# EAGLE design I2C_10p_header (EAGLE 9.6.2)
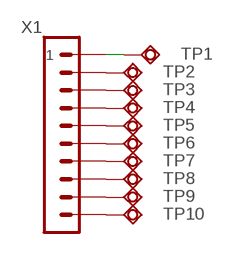
[diagram p0: schematic, sheet 1]

## Parts
TP1  PAD1.5X3.0  [PAD1.5X3.0]
TP2  PAD1.5X3.0  [PAD1.5X3.0]
TP3  PAD1.5X3.0  [PAD1.5X3.0]
TP4  PAD1.5X3.0  [PAD1.5X3.0]
TP5  PAD1.5X3.0  [PAD1.5X3.0]
TP6  PAD1.5X3.0  [PAD1.5X3.0]
TP7  PAD1.5X3.0  [PAD1.5X3.0]
TP8  PAD1.5X3.0  [PAD1.5X3.0]
TP9  PAD1.5X3.0  [PAD1.5X3.0]
TP10  PAD1.5X3.0  [PAD1.5X3.0]
X1  FFC_10PV  [FFC_1X10_VERTICAL]

## Nets
N$1: TP1.P$1 X1.P$1
N$2: TP2.P$1 X1.P$2
N$3: TP3.P$1 X1.P$3
N$4: TP4.P$1 X1.P$4
N$5: TP5.P$1 X1.P$5
N$6: TP6.P$1 X1.P$6
N$7: TP7.P$1 X1.P$7
N$8: TP8.P$1 X1.P$8
N$9: TP9.P$1 X1.P$9
N$10: TP10.P$1 X1.P$10
Unconnected: X1.P$11(SHLD) X1.P$12(SHLD)

## Library data of the parts
TP1-TP10 = SIG_Parts:PAD1.5X3.0
X1 = SIG_Parts:FFC_10P

## Board
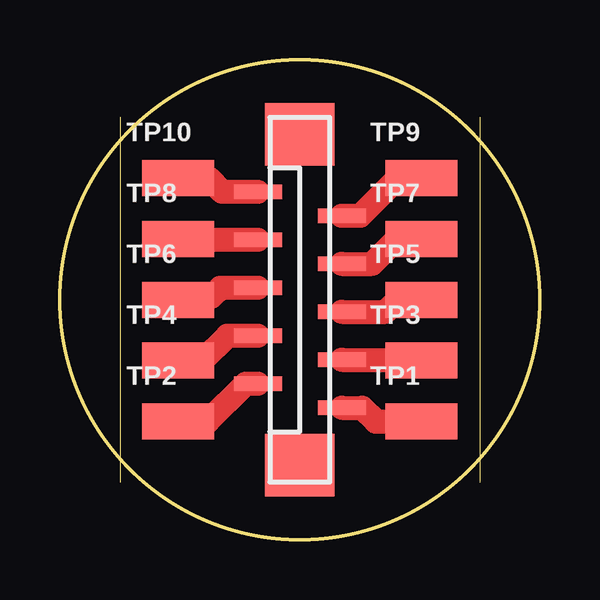
[diagram p1: board, top side]

Size 20 x 20 mm. Coordinates in mm from the lower left corner, seen from the top.
Outline: 2.5,17.62 2.5,2.38
Outline: 17.5,17.62 17.5,2.38
Outline: circle at 10,10 radius 10
Copper layers (1*16): Top 0.035mm / dielectric 0.15mm / Bottom 0.035mm
Design rules "default": minimum track width 6mil, minimum drill 0.35mm, track to track 6mil, track to pad 6mil, pad to pad 6mil, via to via 6mil, smd to smd 6mil, copper to edge 40mil, drill to drill 6mil, minimum pad ring 10mil, minimum via ring 8mil, stop-mask expansion 4mil, vias tented up to drill 0mil, thermal gap 10mil

### Footprints (pad centres in the part's own frame; a part is rotated, then mirrored left to right if it is on the bottom)
PAD1.5X3.0 = smd 3 x 1.5: P$1 0,0
FFC_1X10_VERTICAL = smd 0.6 x 2: P$1 -4.5,-1.75; P$2 -3.5,1.75; P$3 -2.5,-1.75; P$4 -1.5,1.75; P$5 -0.5,-1.75; P$6 0.5,1.75; P$7 1.5,-1.75; P$8 2.5,1.75; P$9 3.5,-1.75; P$10 4.5,1.75 | smd 2.6 x 2.9: P$11 -6.9,0; P$12 6.9,0

### Placement (x,y rotation side)
TP1  15.08,4.92 0 top
TP2  4.92,4.92 0 top
TP3  15.08,7.46 0 top
TP4  4.92,7.46 0 top
TP5  15.08,10 0 top
TP6  4.92,10 0 top
TP7  15.08,12.54 0 top
TP8  4.92,12.54 0 top
TP9  15.08,15.08 0 top
TP10  4.92,15.08 0 top
X1  10,10 90 top

### Tracks (layer width: path | path; a pad name or v marks a point on that pad's centre or on a via)
N$1
  Top 1: X1.P$1 12.6,5.5 13.18,4.92 TP1.P$1
N$2
  Top 1: X1.P$2 7.74,6.5 6.16,4.92 TP2.P$1
N$3
  Top 1: X1.P$3 15.04,7.5 TP3.P$1
N$4
  Top 1: X1.P$4 6.98,8.5 5.94,7.46 TP4.P$1
N$5
  Top 1: X1.P$5 13.56,9.5 14.06,10 TP5.P$1
N$6
  Top 1: X1.P$6 6.69,10.5 6.32,10.13 5.05,10.13 TP6.P$1
N$7
  Top 1: X1.P$7 13.02,11.5 14.06,12.54 TP7.P$1
N$8
  Top 1: X1.P$8 4.96,12.5 TP8.P$1
N$9
  Top 1: X1.P$9 12.51,13.5 14.09,15.08 TP9.P$1
N$10
  Top 1: X1.P$10 6.77,14.5 6.19,15.08 TP10.P$1